# EAGLE design senseBox-Expander_v20 (EAGLE 7.7.0)
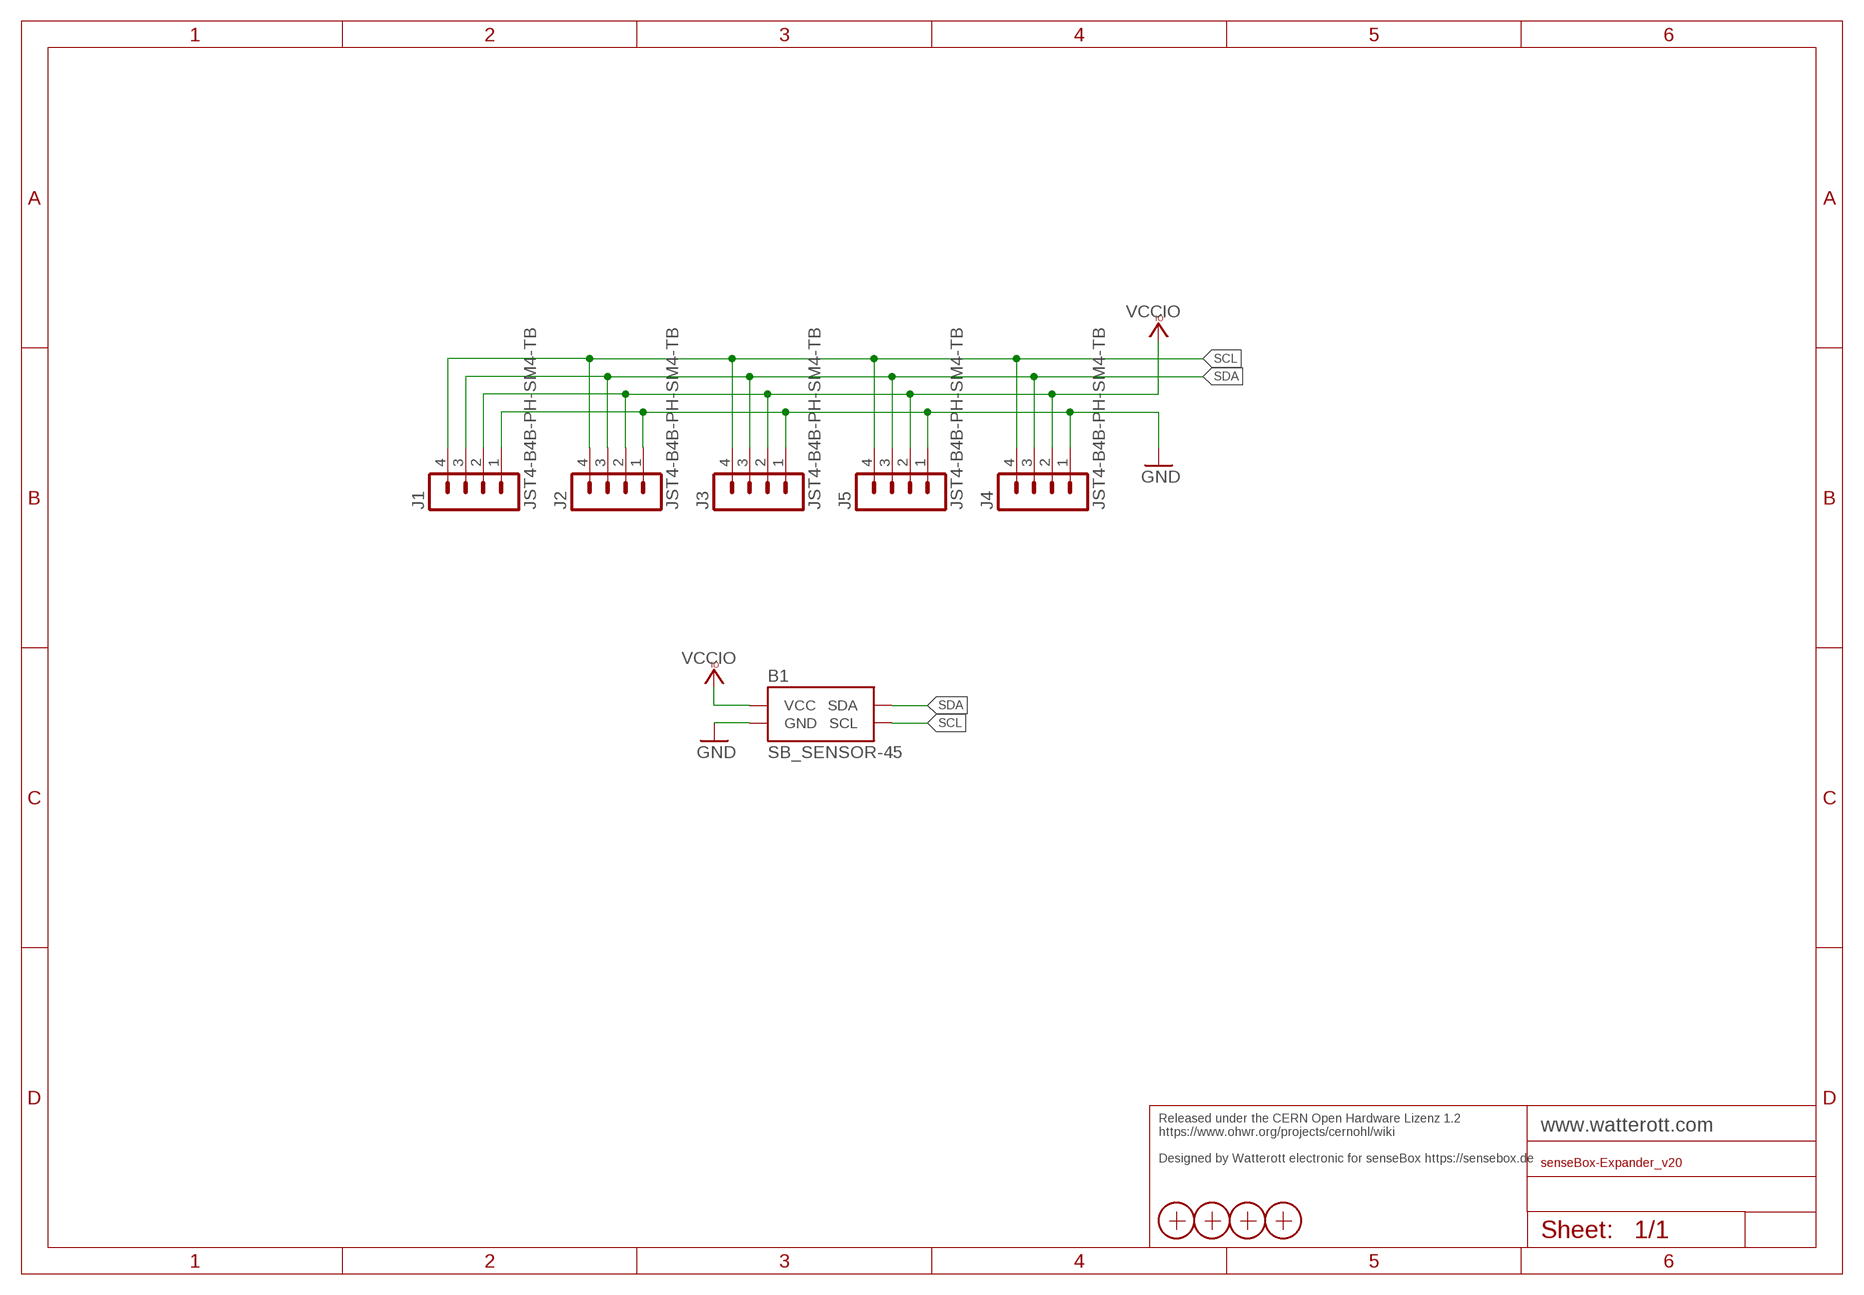
[diagram p0: schematic, sheet 1]

## Parts
B1  SB_SENSOR-45  [SB-45X25]
J1  JST4-B4B-PH-SM4-TB  [JST_B4B-PH-SM4-TB]
J2  JST4-B4B-PH-SM4-TB  [JST_B4B-PH-SM4-TB]
J3  JST4-B4B-PH-SM4-TB  [JST_B4B-PH-SM4-TB]
J4  JST4-B4B-PH-SM4-TB  [JST_B4B-PH-SM4-TB]
J5  JST4-B4B-PH-SM4-TB  [JST_B4B-PH-SM4-TB]
X1  PASSER-07  [PASSER_07MM]
X2  PASSER-07  [PASSER_07MM]
X3  PASSER-07  [PASSER_07MM]
X4  PASSER-07  [PASSER_07MM]

## Nets
GND: B1.GND J1.1 J2.1 J3.1 J4.1 J5.1
SCL: B1.SCL J1.4 J2.4 J3.4 J4.4 J5.4
SDA: B1.SDA J1.3 J2.3 J3.3 J4.3 J5.3
VCCIO: B1.VCC J1.2 J2.2 J3.2 J4.2 J5.2

## Notes on the sheet
- Released under the CERN Open Hardware Lizenz 1.2
  https://www.ohwr.org/projects/cernohl/wiki
  
  Designed by Watterott electronic for senseBox https://sensebox.de

## Library data of the parts
B1 = we-board:SB_SENSOR: SenseBox Sensors/Breakouts
J1-J5 = we-con:JST4: JST Connector
X1-X4 = we-symbol:PASSER: Fiducial Markers

## Board
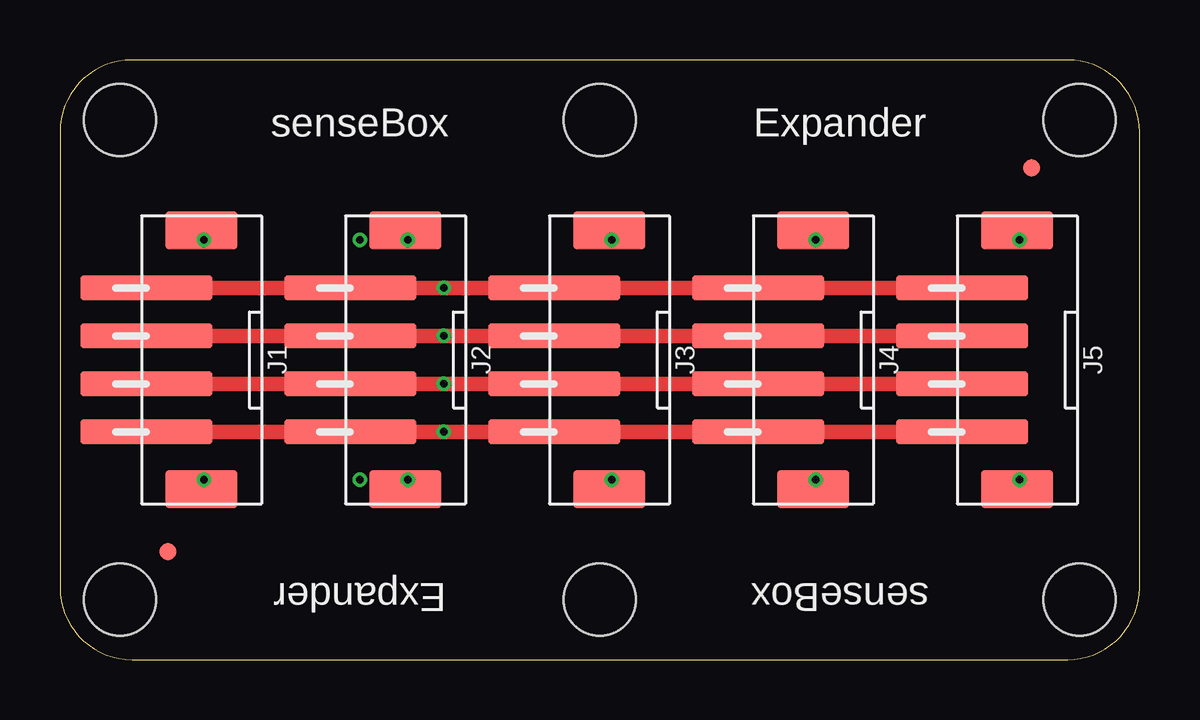
[diagram p1: board, top side]
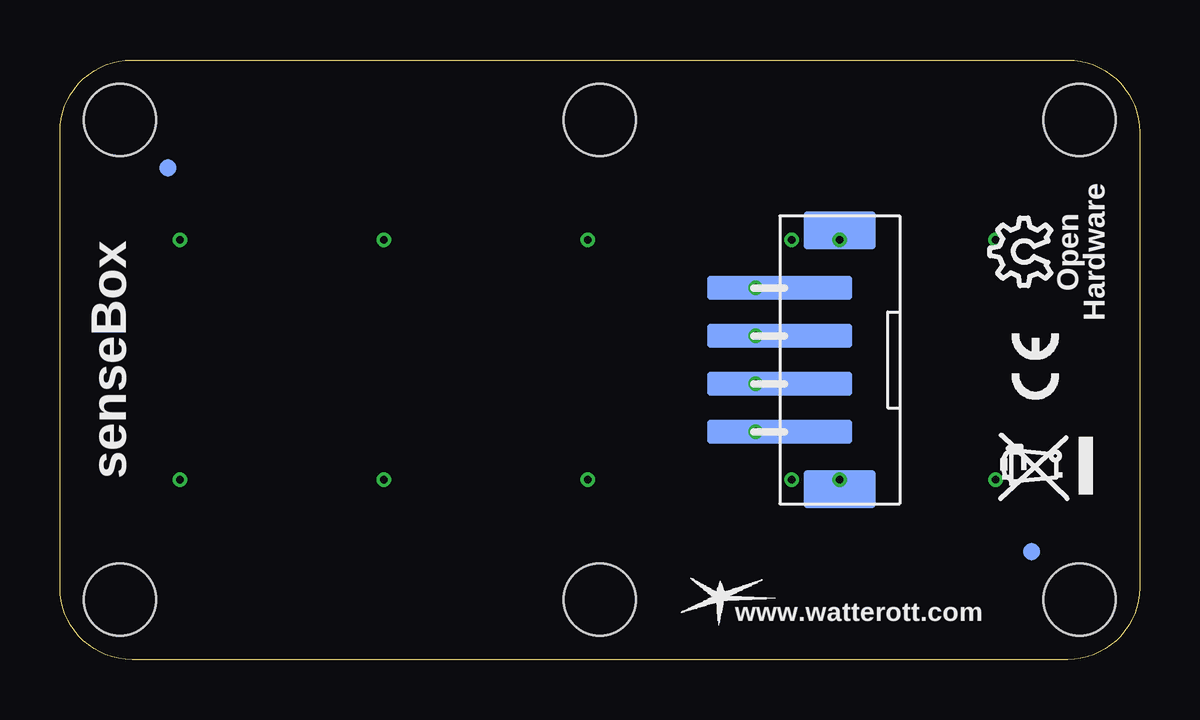
[diagram p2: board, bottom side, seen from below]

Size 45 x 25 mm. Coordinates in mm from the lower left corner, seen from the top.
Copper layers (1*16): Top 0.035mm / dielectric 1.5mm / Bottom 0.035mm
Design rules "we-dru-2-layer": minimum track width 0.15mm, minimum drill 0.3mm, track to track 0.15mm, track to pad 0.15mm, pad to pad 0.15mm, via to via 0.15mm, smd to smd 0.1mm, copper to edge 0.4mm, drill to drill 0.2mm, minimum pad ring 0.18mm, minimum via ring 0.16mm, stop-mask expansion 0.1mm, vias tented up to drill 0.5mm, thermal gap 0.25mm
Holes 3 mm at 22.5,22.5 22.5,2.5

### Footprints (pad centres in the part's own frame; a part is rotated, then mirrored left to right if it is on the bottom)
SB-45X25 = smd 6 x 1 bottom: GND 15,15.5; SCL 15,9.5; SDA 15,11.5; VCC 15,13.5 | smd 3 x 1.6 bottom: SHLD1 12.5,17.9; SHLD2 12.5,7.1 | hole 3: 2.5,22.5; 2.5,2.5; 42.5,22.5; 42.5,2.5
JST_B4B-PH-SM4-TB = smd 5.5 x 1: 1 -2.9,3; 2 -2.9,1; 3 -2.9,-1; 4 -2.9,-3 | smd 3 x 1.6: SHLD1 -0.6,5.4; SHLD2 -0.6,-5.4
PASSER_07MM = smd 0.7 x 0.7: X 0,0

### Placement (x,y rotation side)
B1  0,0 0 top
J1  6.5,12.5 0 top
J2  15,12.5 0 top
J3  23.5,12.5 0 top
J4  32,12.5 0 top
J5  40.5,12.5 0 top
X1  40.5,20.5 0 top
X2  4.5,4.5 0 top
X3  4.5,4.5 0 bottom
X4  40.5,20.5 0 bottom

### Tracks (layer width: path | path; a pad name or v marks a point on that pad's centre or on a via)
GND  (via drill 0.3)
  Top 0.61: J5.1 J4.1 J3.1 v16,15.5 J2.1 J1.1
  Bottom 0.61: B1.GND v16,15.5
N$1  (via drill 0.3)
  other vias: 6,17.5
N$2  (via drill 0.3)
  other vias: 12.5,17.5
N$3  (via drill 0.3)
  other vias: 12.5,7.5
N$4  (via drill 0.3)
  other vias: 6,7.5
N$5  (via drill 0.3)
  other vias: 14.5,7.5
N$6  (via drill 0.3)
  other vias: 23,7.5
N$7  (via drill 0.3)
  other vias: 31.5,7.5
N$8  (via drill 0.3)
  other vias: 40,7.5
N$9  (via drill 0.3)
  other vias: 40,17.5
N$10  (via drill 0.3)
  other vias: 31.5,17.5
N$11  (via drill 0.3)
  other vias: 23,17.5
N$12  (via drill 0.3)
  other vias: 14.5,17.5
SCL  (via drill 0.3)
  Top 0.61: J5.4 J4.4 J3.4 v16,9.5 J2.4 J1.4
  Bottom 0.61: B1.SCL v16,9.5
SDA  (via drill 0.3)
  Top 0.61: J5.3 J4.3 J3.3 v16,11.5 J2.3 J1.3
  Bottom 0.61: B1.SDA v16,11.5
VCCIO  (via drill 0.3)
  Top 0.61: J5.2 J4.2 J3.2 v16,13.5 J2.2 J1.2
  Bottom 0.61: B1.VCC v16,13.5

### Text on the board
tPlace: senseBox | Expander | Expander | senseBox
Reference: Silkscreen: 21 tPlace + 22 bPlace